# EasyEDA schematic routeur_wemos_Maxi_v1.1c_2020-05-14_15-58-55.json
TITLE: Sheet_1; REV: 1.0; Date: 2020-04-02; Sheet: 1/1; Drawn By: vaneay; Company: Your Company
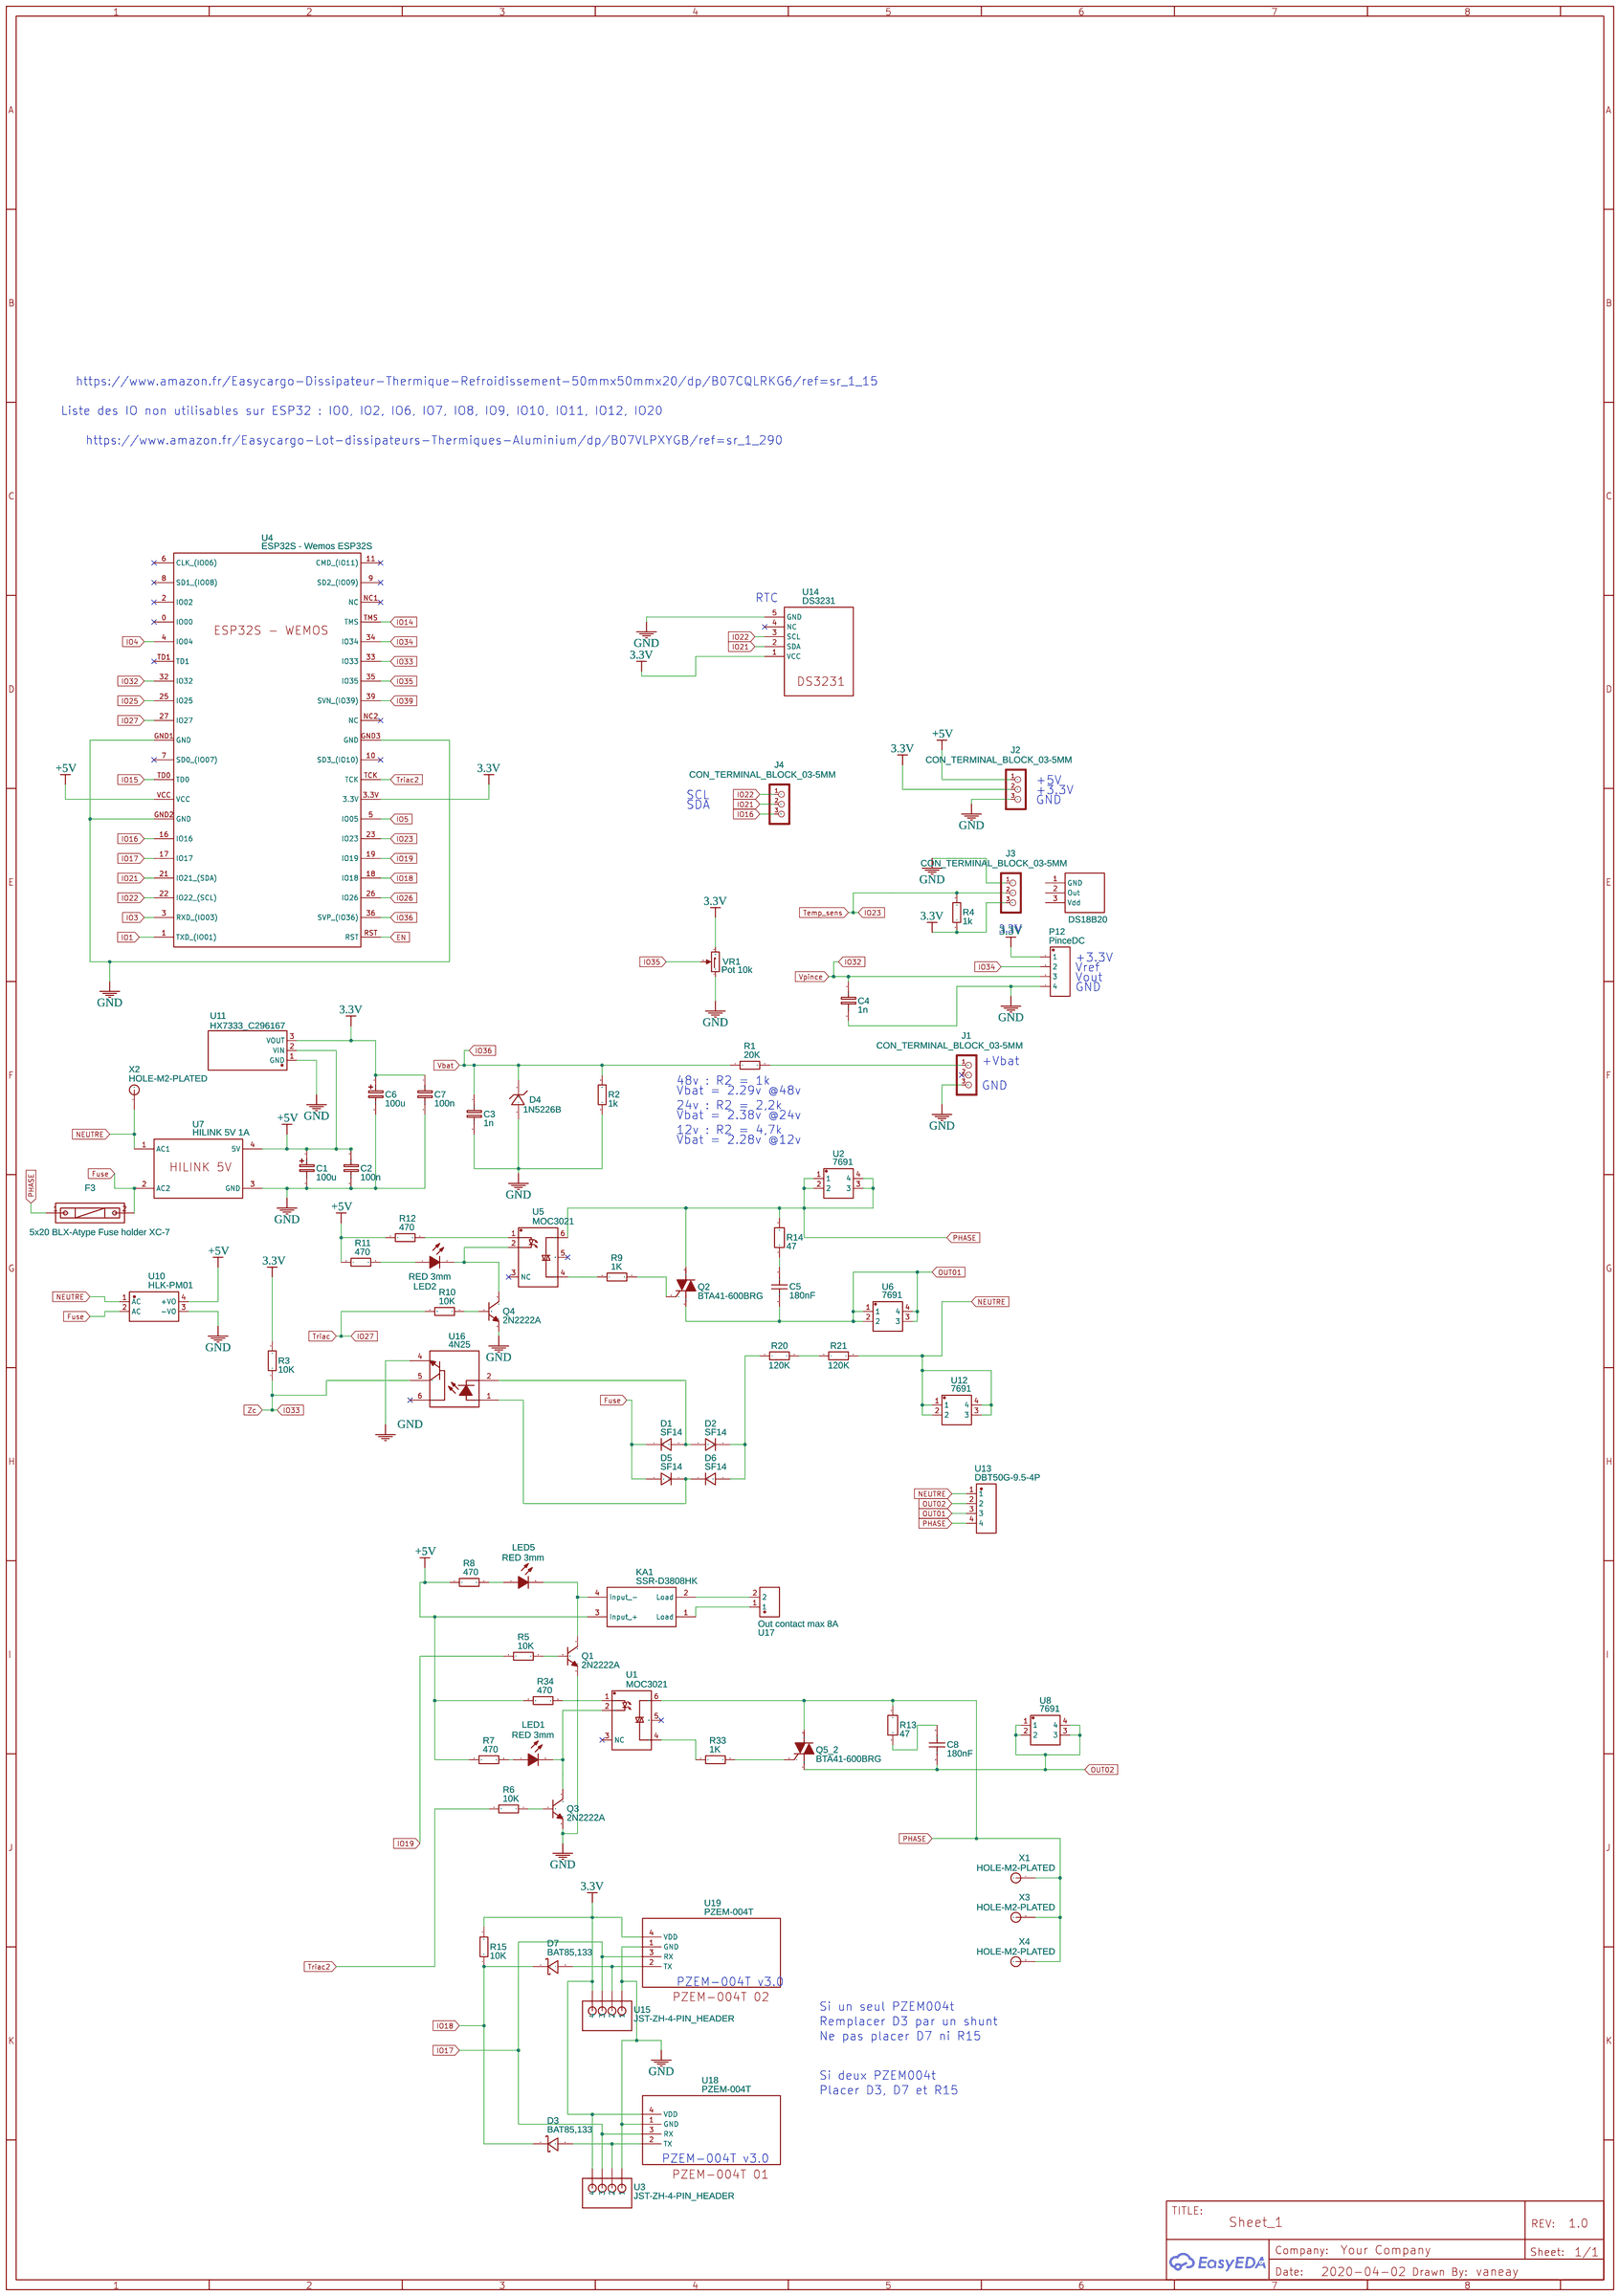
[diagram p0: schematic sheet]

## Parts
C1  100u  [CAP-TH_BD5.0-P2.00-D0.8-FD]
C2  100n  [WIMA 5MM 3.5X7.2]
C3  1n  [WIMA 5MM 3.5X7.2]
C4  1n  [WIMA 5MM 3.5X7.2]
C5  180nF  [CAP-TH_L18.0-W6.0-P15.00-D1.2]
C6  100u  [CAP-TH_BD5.0-P2.00-D0.8-FD]
C7  100n  [WIMA 5MM 3.5X7.2]
C8  180nF  [CAP-TH_L18.0-W6.0-P15.00-D1.2]
D1  SF14  [DO-41_BD2.4-L4.7-P8.70-D0.9-RD]
D2  SF14  [DO-41_BD2.4-L4.7-P8.70-D0.9-RD]
D3  BAT85,133  [DO-34_BD1.6-L3.0-P7.00-D0.6-RD]
D4  1N5226B  [DO-35_BD2.0-L4.2-P8.20-D0.5-RD]
D5  SF14  [DO-41_BD2.4-L4.7-P8.70-D0.9-RD]
D6  SF14  [DO-41_BD2.4-L4.7-P8.70-D0.9-RD]
D7  BAT85,133  [DO-34_BD1.6-L3.0-P7.00-D0.6-RD]
F3  5x20 BLX-Atype Fuse holder XC-7  [FUSE-TH_L22.6-W9.0]
J1  CON_TERMINAL_BLOCK_03-5MM  [TERMINAL_BLOCK_3P_5]
J2  CON_TERMINAL_BLOCK_03-5MM  [TERMINAL_BLOCK_3P_5]
J3  CON_TERMINAL_BLOCK_03-5MM  [TERMINAL_BLOCK_3P_5]
J4  CON_TERMINAL_BLOCK_03-5MM  [TERMINAL_BLOCK_3P_5]
KA1  SSR-D3808HK  [SSR-D3808HK 8A]
LED1  RED 3mm  [LED-TH_BD3.0-P2.54-FD]
LED2  RED 3mm  [LED-TH_BD3.0-P2.54-FD]
LED5  RED 3mm  [LED-TH_BD3.0-P2.54-FD]
P12  PinceDC  [WJ2EDGVC-5.08-4P]
Q1  2N2222A  [TO-92-3_L4.8-W3.7-P2.54-R]
Q2  BTA41-600BRG  [TOP3-1]
Q3  2N2222A  [TO-92-3_L4.8-W3.7-P2.54-R]
Q4  2N2222A  [TO-92-3_L4.8-W3.7-P2.54-R]
Q5_2  BTA41-600BRG  [TOP3-1]
R1  20K  [AXIAL-0.3]
R2  1k  [AXIAL-0.3]
R3  10K  [AXIAL-0.3]
R4  1k  [AXIAL-0.3]
R5  10K  [AXIAL-0.3]
R6  10K  [AXIAL-0.3]
R7  470  [AXIAL-0.3]
R8  470  [AXIAL-0.3]
R9  1K  [RES-TH_BD3.3-L9.0-P13.00-D0.6]
R10  10K  [AXIAL-0.3]
R11  470  [AXIAL-0.3]
R12  470  [AXIAL-0.3]
R13  47  [RES-TH_BD4.5-L11.0-P15.00-D0.8]
R14  47  [RES-TH_BD4.5-L11.0-P15.00-D0.8]
R15  10K  [AXIAL-0.3]
R20  120K  [RES-TH_BD3.3-L9.0-P13.00-D0.6]
R21  120K  [RES-TH_BD3.3-L9.0-P13.00-D0.6]
R33  1K  [RES-TH_BD3.3-L9.0-P13.00-D0.6]
R34  470  [AXIAL-0.3]
U1  MOC3021  [DIP-6_L8.5-W6.4-P2.54-LS7.6-BL]
U2  7691  [CONN-TH_4P-P5.00-S7.00_L8.0-W8.0]
U3  JST-ZH-4-PIN_HEADER  [JST-ZH-4 1.5MM]
U4  ESP32S - Wemos ESP32S  [ESP32-TEST]
U5  MOC3021  [DIP-6_L8.5-W6.4-P2.54-LS7.6-BL]
U6  7691  [CONN-TH_4P-P5.00-S7.00_L8.0-W8.0]
U7  HILINK 5V 1A  [FP_HILINK_5V_1A]
U8  7691  [CONN-TH_4P-P5.00-S7.00_L8.0-W8.0]
U9  DS18B20
U10  HLK-PM01  [PWRM-TH_HLK-PM01]
U11  HX7333_C296167  [TO-92-3_L4.9-W3.7-P1.27-L]
U12  7691  [CONN-TH_4P-P5.00-S7.00_L8.0-W8.0]
U13  DBT50G-9.5-4P  [CONN-TH_4PIN-V-PITCH9.50-L_DBT50G-9.5-4P]
U14  DS3231  [DS3231]
U15  JST-ZH-4-PIN_HEADER  [JST-ZH-4 1.5MM]
U16  4N25  [DIP-6(7.12X6.4)]
U17  Out contact max 8A  [CONN-TH_2P-P10.00_L10.0-W15.0]
U18  PZEM-004T  [PZEM-004T]
U19  PZEM-004T  [PZEM-004T]
VR1  Pot 10k  [SINGLEPOT]
X1  HOLE-M2-PLATED  [HOLE_M2]
X2  HOLE-M2-PLATED  [HOLE_M2]
X3  HOLE-M2-PLATED  [HOLE_M2]
X4  HOLE-M2-PLATED  [HOLE_M2]

## Library data of the parts
C1 C6 = Cap_Electrolytic(TH)_D3.0XF1.5_EU: Contributor: EasyEDA; Package Display: No; Supplier: LCSC; Supplier Part: C122609
C2 C7 = Cap_RAD-0.1_EU: Package Display: No; Supplier: LCSC; Supplier Part: C94717
C3 C4 = Cap_RAD-0.1_EU: Package Display: No; Supplier: LCSC; Supplier Part: C192448
C5 C8 = SMXDX184KD2XXAB1515: Supplier: LCSC; Supplier Part: C155792; Manufacturer: DAIN Elec; Contributor: LCSC
D1 D2 D5 D6 = SF14: Supplier: LCSC; Supplier Part: C331690; Manufacturer: GW; Contributor: LCSC
D3 D7 = BAT85,133: Supplier: LCSC; Manufacturer: Nexperia; Contributor: LCSC; Supplier Part: C134301
D4 = 1N751A: Supplier: LCSC; Contributor: LCSC; Supplier Part: C51291; Package Display: No
F3 = 5x20 BLX-Atype Fuse holder XC-7: Supplier: LCSC; Manufacturer: XCFuse; image: //image.lceda.cn/szlcsc/C3131.jpg; Supplier Part: C3131
J1-J4 = -: 3 poles, wire to board connector; Contributor: DangerousPrototype; Manufacturer Part: ?; Package Display: No; Supplier: LCSC; Supplier Part: C182803
KA1 = SSR-D3808HK: Supplier: HOYMK; Contributor: fslomp
LED1 LED2 LED5 = 204-10SURD/S530-A3-L: Supplier: LCSC; Manufacturer: EVERLIGHT; Supplier Part: C99771
P12 = WJ2EDGVC-5.08-4P: Supplier: LCSC; Manufacturer: Dinkle; Manufacturer Part: EK508V-04P; image: //image.lceda.cn/szlcsc/C8436.jpg; Supplier Part: C182807; Package Display: No
Q1 Q3 Q4 = 2N2222A: Supplier: LCSC; Supplier Part: C358533; Manufacturer: Foshan Blue Rocket Elec; Contributor: LCSC
Q2 Q5_2 = BTA41-600BRG: Supplier: LCSC; Manufacturer: STMicroelectronics; image: //image.lceda.cn/szlcsc/C9103.jpg; Contributor: LCSC; Supplier Part: C9103
R1 R2 R4 R7 R8 R11 R12 R34 = 0805: Supplier: LCSC; Supplier Part: C58592; Contributor: LCSC; Package Display: No
R3 R5 R6 R10 R15 = 0805: Supplier: LCSC; Supplier Part: C57436; Contributor: LCSC; Package Display: No
R9 R33 = MFR1WSJT-52-5K1: Supplier: LCSC; Supplier Part: C385291; Contributor: LCSC; Package Display: No
R13 R14 = RN 2WS 47R F T/B A1: Supplier: LCSC; Supplier Part: C433590; Manufacturer: TyoHM; Contributor: LCSC
R20 R21 = MFR1WSJT-52-5K1: Supplier: LCSC; Supplier Part: C433673; Contributor: LCSC; Package Display: No
U1 U5 = MOC3021: Supplier: LCSC; Supplier Part: C123202; Manufacturer: Lite-On; Contributor: LCSC
U2 U6 U8 U12 = 7691: Supplier: LCSC; Supplier Part: C238163; Manufacturer: Keystone; Contributor: LCSC
U3 U15 = JST-ZH-4-PIN_HEADER: Package Display: No; Supplier: LCSC; Supplier Part: C163034
U4 = ESP32S - Wemos ESP32S: Manufacturer Part: ESP32S; Contributor: Vanya_van5
U7 = HILINK 5V corrected: Manufacturer Part: HLK-5M05; Contributor: bruno.cadet; Package Display: No; Supplier: LCSC; Supplier Part: C209907; Manufacturer: HI-LINK
U9 = DS18B20: Contributor: learn456; Package Display: No
U10 = HLK-PM01: Supplier: LCSC; Supplier Part: C209903; Manufacturer: HI-LINK; Contributor: LCSC
U11 = HX7333_C296167: Supplier: LCSC; Supplier Part: C296167; Manufacturer: hengjiaxing; Manufacturer Part: HX7333; Contributor: ç«‹åˆ›EDAå®˜æ–¹å°è£…åº“
U13 = DBT50G-9.5-4P: Supplier: LCSC; Supplier Part: C395960; Manufacturer: DIBO; Contributor: LCSC
U14 = DS3231: link: Small Formfactor For Raspberry PI; Contributor: Skulk; Package Display: No; Supplier Part: https://www.amazon.fr/Delicacydex-dhorloge-arduino-Batterie-Raspberry/dp/B07P6RHHKX/ref=sr_1_2
U16 = 4N25: Supplier: LCSC; Manufacturer: EVERLIGHT; Contributor: Crescyl Angelie dela Cruz; Supplier Part: C115480
U17 = 282858-2: Supplier: LCSC; Supplier Part: C306150; Manufacturer: TE Connectivity; Contributor: LCSC
U18 = PZEM-004T: Manufacturer Part: New SchematicLib; Contributor: kostecki
U19 = PZEM-004T: Manufacturer Part: New SchematicLib; Contributor: kostecki; Package Display: No
VR1 = Pot: Contributor: jesuecc83; license: https://www.gnu.org/licenses/lgpl-2.1.html
X1-X4 = HOLE-M2-PLATED: Manufacturer Part: New SchematicLib; Contributor: lobueno

## Nets
3.3V: C6.1 C7.1 J2.2 J3.3 P12.1 R3.2 R4.1 R15.2 U3.P4(4) U4.3.3V U11.3(VOUT) U14.1(VCC) U15.P4(4) U18.4(VDD) U19.4(VDD) VR1.3
+5V: C1.1 C2.1 J2.1 KA1.3(Input +) R7.1 R8.1 R11.1 R12.1 R34.1 U4.VCC U7.4(5V) U10.4(+VO) U11.2(VIN)
GND: C1.2 C2.2 C3.2 C4.2 C6.2 C7.2 D4.2(A) J1.3 J2.3 J3.1 P12.4 Q1.3(E) Q3.3(E) Q4.3(E) R2.1 U3.P1(1) U4.GND1(GND) U4.GND2(GND) U4.GND3(GND) U7.3(GND) U10.3(-VO) U11.1(GND) U14.5(GND) U15.P1(1) U16.4 U18.1(GND) U19.1(GND) VR1.1
EN: U4.RST
Fuse: D1.1 D5.2 F3.2 U7.2(AC2) U10.2(AC)
IO1: U4.1(TXD (IO01))
IO3: U4.3(RXD (IO03))
IO4: U4.4(IO04)
IO5: U4.5(IO05)
IO14: U4.TMS
IO15: U4.TD0
IO16: J4.3 U4.16(IO16)
IO17: U3.P3(3) U4.17(IO17) U15.P3(3) U18.3(RX) U19.3(RX)
IO18: D3.1(K) D7.1(K) R15.1 U4.18(IO18)
IO19: R5.2 U4.19(IO19)
IO21: J4.2 U4.21(IO21 (SDA)) U14.2(SDA)
IO22: J4.1 U4.22(IO22 (SCL)) U14.3(SCL)
IO23: J3.2 R4.2 U4.23(IO23)
IO25: U4.25(IO25)
IO26: U4.26(IO26)
IO27: R10.2 U4.27(IO27)
IO32: C4.1 P12.3 U4.32(IO32)
IO33: R3.1 U4.33(IO33) U16.5
IO34: P12.2 U4.34(IO34)
IO35: U4.35(IO35) VR1.2
IO36: C3.1 D4.1(C) R1.1 R2.2 U4.36(SVP (IO36))
IO39: U4.39(SVN (IO39))
NEUTRE: R21.2 U7.1(AC1) U10.1(AC) U12.1 U12.2 U12.3 U12.4 U13.1 X2.1
OUT01: C5.2 Q2.1(M1) U6.1 U6.2 U6.3 U6.4 U13.3
OUT02: C8.2 Q5_2.1(M1) U8.1 U8.2 U8.3 U8.4 U13.2
PHASE: F3.1 Q2.2(M2) Q5_2.2(M2) R13.2 R14.2 U1.6(BASE) U2.1 U2.2 U2.3 U2.4 U5.6(BASE) U13.4 X1.1 X3.1 X4.1
Triac2: R6.2 U4.TCK
Net-(C5-1): C5.1 R14.1
Net-(C8-1): C8.1 R13.1
Net-(D1-2): D1.2 D2.2 U16.2
Net-(D2-1): D2.1 D6.2 R20.1
Net-(D3-2): D3.2(A) U3.P2(2) U18.2(TX)
Net-(D5-1): D5.1 D6.1 U16.1
Net-(D7-2): D7.2(A) U15.P2(2) U19.2(TX)
Net-(J1-1): J1.1 R1.2
Net-(KA1-1): KA1.1(Load) U17.1
Net-(KA1-2): KA1.2(Load) U17.2
Net-(KA1-4): KA1.4(Input -) LED5.2(K) Q1.1(C)
Net-(LED1-1): LED1.1(A) R7.2
Net-(LED1-2): LED1.2(K) Q3.1(C) U1.2
Net-(LED2-1): LED2.1(A) R11.2
Net-(LED2-2): LED2.2(K) Q4.1(C) U5.2
Net-(LED5-1): LED5.1(A) R8.2
Net-(Q1-2): Q1.2(B) R5.1
Net-(Q2-3): Q2.3(G) R9.2
Net-(Q3-2): Q3.2(B) R6.1
Net-(Q4-2): Q4.2(B) R10.1
Net-(Q5_2-3): Q5_2.3(G) R33.2
Net-(R9-1): R9.1 U5.4(E)
Net-(R12-2): R12.2 U5.1
Net-(R20-2): R20.2 R21.1
Net-(R33-1): R33.1 U1.4(E)
Net-(R34-2): R34.2 U1.1

Not connected (* = marked no-connect by the designer): J1 2*; U1 3(NC)* 5(SUB)*; U4 0(IO00)* 2(IO02)* 6(CLK (IO06))* 7(SD0 (IO07))* 8(SD1 (IO08))* 9(SD2 (IO09))* 10(SD3 (IO10))* 11(CMD (IO11))* NC1(NC)* NC2(NC)* TD1*; U5 3(NC)* 5(SUB)*; U9 1(GND) 2(Out) 3(Vdd); U14 4(NC)*; U16 6*

## Notes on the sheet
- https://www.amazon.fr/Easycargo-Dissipateur-Thermique-Refroidissement-50mmx50mmx20/dp/B07CQLRKG6/ref=sr_1_15
- Liste des IO non utilisables sur ESP32 : IO0, IO2, IO6, IO7, IO8, IO9, IO10, IO11, IO12, IO20
- https://www.amazon.fr/Easycargo-Lot-dissipateurs-Thermiques-Aluminium/dp/B07VLPXYGB/ref=sr_1_290
- RTC
- +5V
- SCL
- +3.3V
- SDA
- GND
- 3.3V
- +3.3V
- Vref
- Vout
- GND
- +Vbat
- 48v : R2 = 1k
- GND
- Vbat = 2.29v @48v
- 24v : R2 = 2,2k
- Vbat = 2.38v @24v
- 12v : R2 = 4,7k
- Vbat = 2.28v @12v
- PZEM-004T v3.0
- Si un seul PZEM004t
- Remplacer D3 par un shunt
- Ne pas placer D7 ni R15
- Si deux PZEM004t
- Placer D3, D7 et R15
- PZEM-004T v3.0
